# EAGLE schematic VDivider (EAGLE 9.4.2)
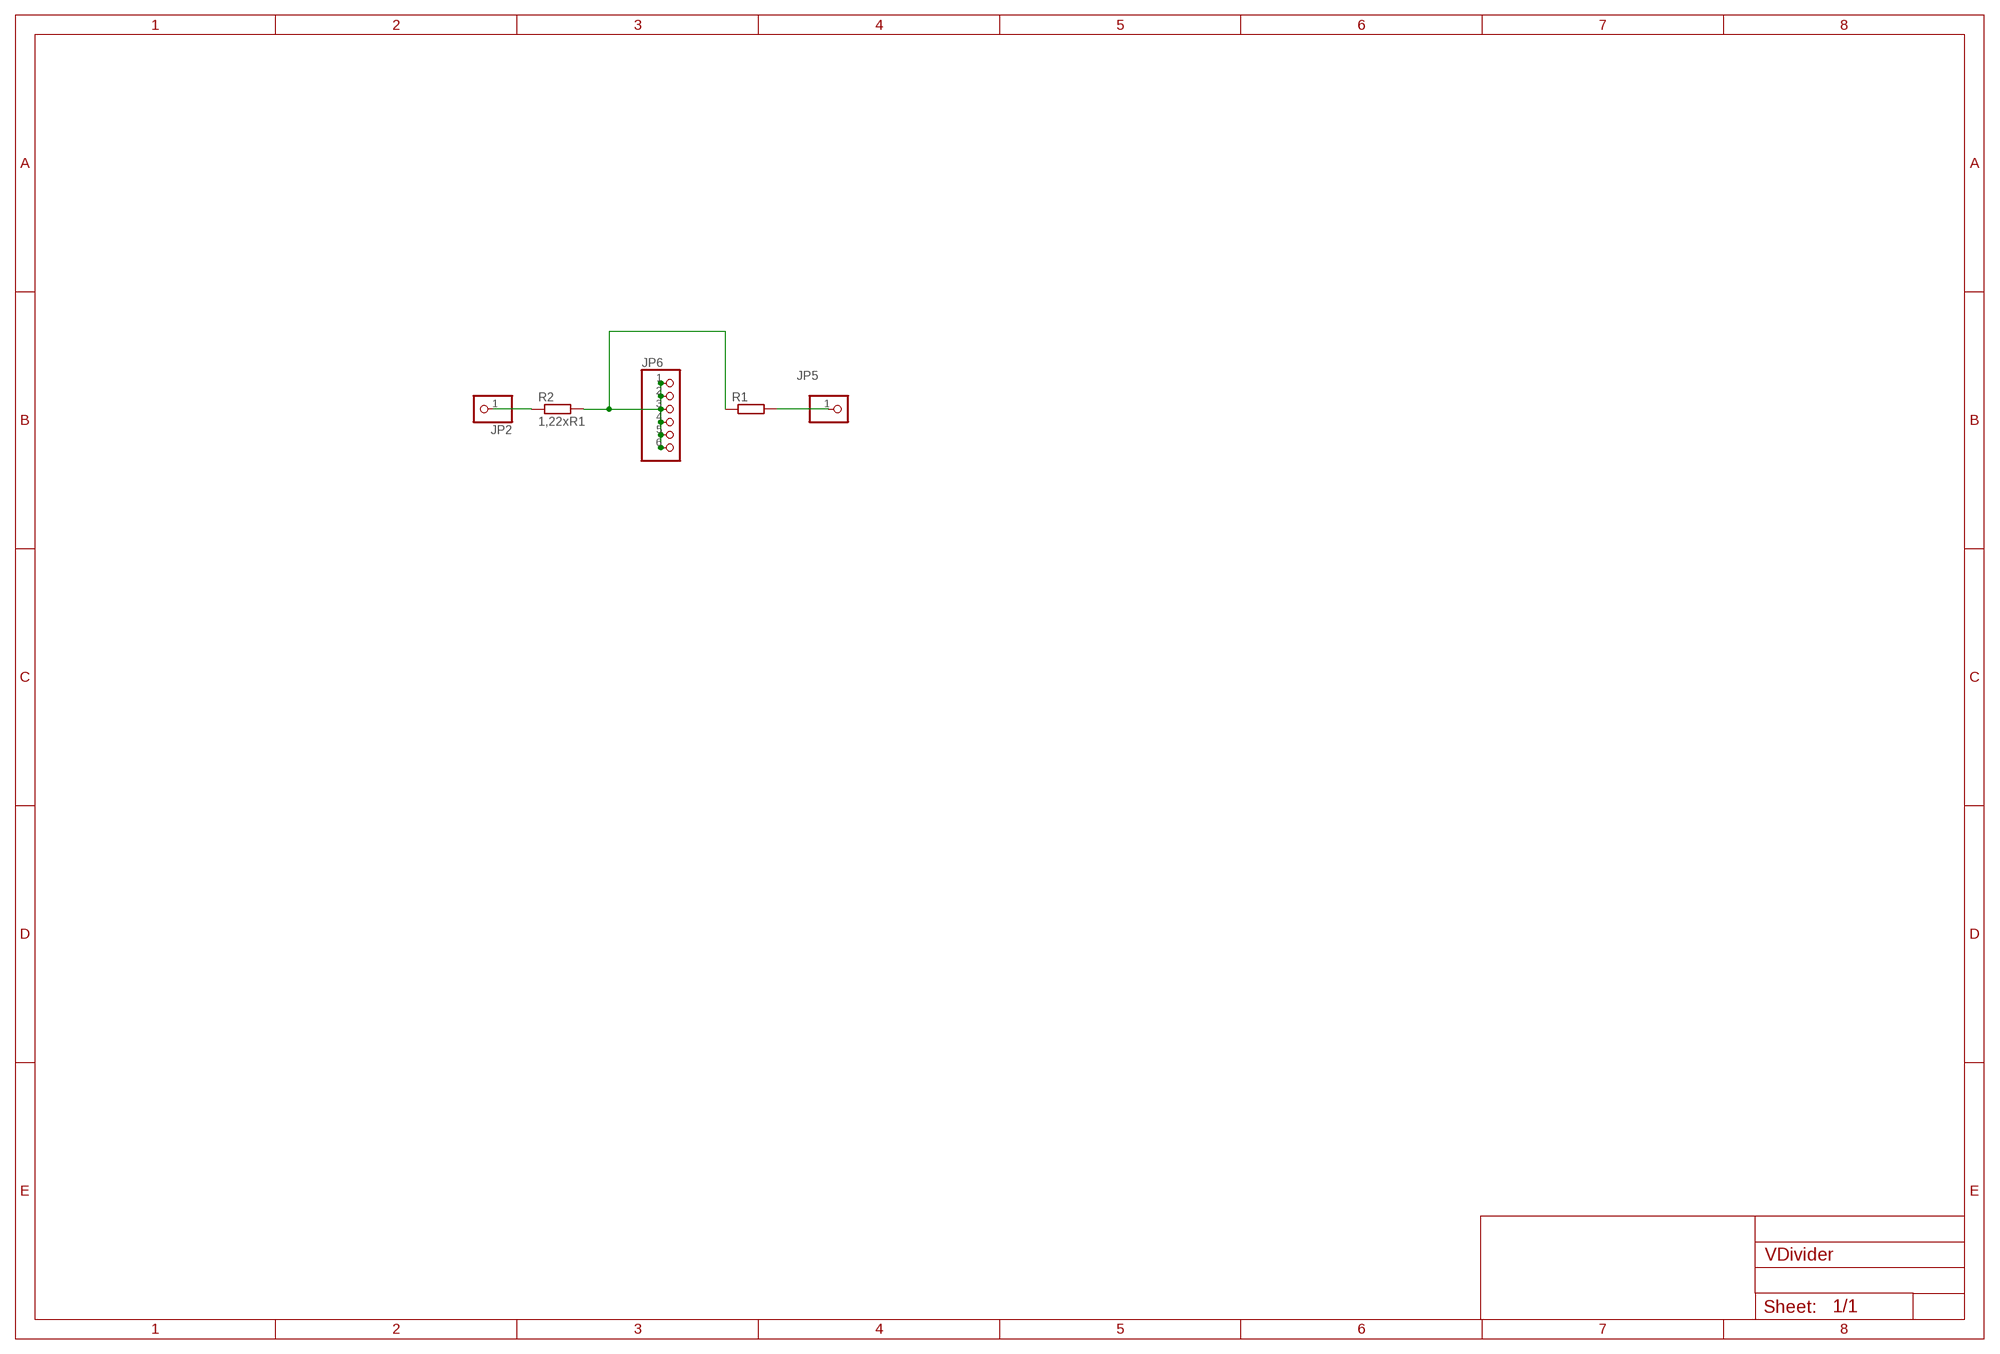
[diagram p0: schematic, sheet 1]

## Parts
JP2  PINHD-1X1  [1X01]
JP5  PINHD-1X1  [1X01]
JP6  PINHD-1X6  [1X06]
R1  R-EU_0204/7  [0204/7]
R2  1,22xR1  R-EU_0204/7  [0204/7]

## Nets
N$1: JP2.1 R2.1
N$2: JP6.1 JP6.2 JP6.3 JP6.4 JP6.5 JP6.6 R1.1 R2.2
N$4: JP5.1 R1.2

## Library data of the parts
JP2 JP5 = pinhead:PINHD-1X1: PIN HEADER
JP6 = pinhead:PINHD-1X6: PIN HEADER
R1 R2 = rcl:R-EU_: RESISTOR, European symbol; SPICEPREFIX: R